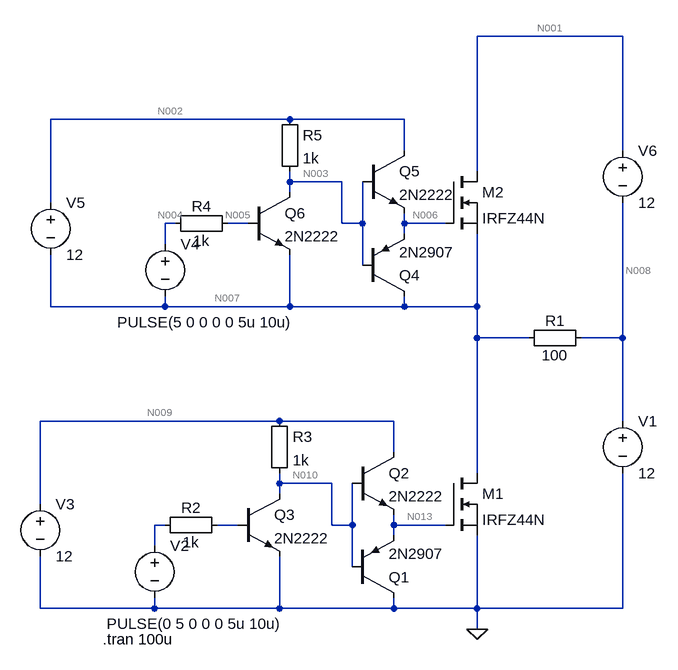
[diagram p0: schematic Drive4.asc]
Drive4.asc, the LTspice schematic file:
Version 4
SHEET 1 880 1392
WIRE -2688 448 -2912 448
WIRE -3200 576 -3568 576
WIRE -3024 576 -3200 576
WIRE -3024 624 -3024 576
WIRE -2688 624 -2688 448
WIRE -2912 656 -2912 448
WIRE -3200 672 -3200 656
WIRE -3120 672 -3200 672
WIRE -3200 688 -3200 672
WIRE -3568 704 -3568 576
WIRE -3376 736 -3392 736
WIRE -3264 736 -3296 736
WIRE -3120 736 -3120 672
WIRE -3088 736 -3088 672
WIRE -3088 736 -3120 736
WIRE -3024 736 -3024 720
WIRE -2960 736 -3024 736
WIRE -3024 752 -3024 736
WIRE -3392 768 -3392 736
WIRE -3088 800 -3088 736
WIRE -3568 864 -3568 784
WIRE -3392 864 -3392 848
WIRE -3392 864 -3568 864
WIRE -3200 864 -3200 784
WIRE -3200 864 -3392 864
WIRE -3024 864 -3024 848
WIRE -3024 864 -3200 864
WIRE -2912 864 -2912 752
WIRE -2912 864 -3024 864
WIRE -2912 912 -2912 864
WIRE -2832 912 -2912 912
WIRE -2688 912 -2688 704
WIRE -2688 912 -2752 912
WIRE -3216 1040 -3584 1040
WIRE -3040 1040 -3216 1040
WIRE -2688 1040 -2688 912
WIRE -3040 1088 -3040 1040
WIRE -2912 1120 -2912 912
WIRE -3216 1136 -3216 1120
WIRE -3136 1136 -3216 1136
WIRE -3216 1152 -3216 1136
WIRE -3584 1168 -3584 1040
WIRE -3392 1200 -3408 1200
WIRE -3280 1200 -3312 1200
WIRE -3136 1200 -3136 1136
WIRE -3104 1200 -3104 1136
WIRE -3104 1200 -3136 1200
WIRE -3040 1200 -3040 1184
WIRE -2960 1200 -3040 1200
WIRE -3040 1216 -3040 1200
WIRE -3408 1232 -3408 1200
WIRE -3104 1264 -3104 1200
WIRE -3584 1328 -3584 1248
WIRE -3408 1328 -3408 1312
WIRE -3408 1328 -3584 1328
WIRE -3216 1328 -3216 1248
WIRE -3216 1328 -3408 1328
WIRE -3040 1328 -3040 1312
WIRE -3040 1328 -3216 1328
WIRE -2912 1328 -2912 1216
WIRE -2912 1328 -3040 1328
WIRE -2688 1328 -2688 1120
WIRE -2688 1328 -2912 1328
WIRE -2912 1360 -2912 1328
FLAG -2912 1360 0
SYMBOL nmos -2960 1120 R0
SYMATTR InstName M1
SYMATTR Value IRFZ44N
SYMBOL voltage -2688 1024 R0
WINDOW 123 0 0 Left 0
WINDOW 39 0 0 Left 0
SYMATTR InstName V1
SYMATTR Value 12
SYMBOL Misc\\EuropeanResistor -2736 896 R90
WINDOW 0 5 56 VBottom 2
WINDOW 3 27 56 VTop 2
SYMATTR InstName R1
SYMATTR Value 100
SYMBOL Misc\\EuropeanResistor -3408 1216 R270
WINDOW 0 27 56 VTop 2
WINDOW 3 5 56 VBottom 2
SYMATTR InstName R2
SYMATTR Value 1k
SYMBOL voltage -3408 1216 R0
WINDOW 3 -74 136 Left 2
WINDOW 123 0 0 Left 0
WINDOW 39 0 0 Left 0
SYMATTR Value PULSE(0 5 0 0 0 5u 10u)
SYMATTR InstName V2
SYMBOL pnp -3104 1312 M180
SYMATTR InstName Q1
SYMATTR Value 2N2907
SYMBOL npn -3104 1088 R0
SYMATTR InstName Q2
SYMATTR Value 2N2222
SYMBOL voltage -3584 1152 R0
WINDOW 123 0 0 Left 0
WINDOW 39 0 0 Left 0
SYMATTR InstName V3
SYMATTR Value 12
SYMBOL Misc\\EuropeanResistor -3232 1024 R0
SYMATTR InstName R3
SYMATTR Value 1k
SYMBOL npn -3280 1152 R0
SYMATTR InstName Q3
SYMATTR Value 2N2222
SYMBOL nmos -2960 656 R0
SYMATTR InstName M2
SYMATTR Value IRFZ44N
SYMBOL Misc\\EuropeanResistor -3392 752 R270
WINDOW 0 27 56 VTop 2
WINDOW 3 5 56 VBottom 2
SYMATTR InstName R4
SYMATTR Value 1k
SYMBOL voltage -3392 752 R0
WINDOW 3 -74 136 Left 2
WINDOW 123 0 0 Left 0
WINDOW 39 0 0 Left 0
SYMATTR Value PULSE(5 0 0 0 0 5u 10u)
SYMATTR InstName V4
SYMBOL pnp -3088 848 M180
SYMATTR InstName Q4
SYMATTR Value 2N2907
SYMBOL npn -3088 624 R0
SYMATTR InstName Q5
SYMATTR Value 2N2222
SYMBOL Misc\\EuropeanResistor -3216 560 R0
SYMATTR InstName R5
SYMATTR Value 1k
SYMBOL npn -3264 688 R0
SYMATTR InstName Q6
SYMATTR Value 2N2222
SYMBOL voltage -3568 688 R0
WINDOW 123 0 0 Left 0
WINDOW 39 0 0 Left 0
SYMATTR InstName V5
SYMATTR Value 12
SYMBOL voltage -2688 608 R0
WINDOW 123 0 0 Left 0
WINDOW 39 0 0 Left 0
SYMATTR InstName V6
SYMATTR Value 12
TEXT -3488 1376 Left 2 !.tran 100u

The netlist it stands for:
* Drive4.asc
M1 N007 N013 0 0 IRFZ44N
V1 N008 0 12
R1 N008 N007 100
R2 N011 N012 1k
V2 N011 0 PULSE(0 5 0 0 0 5u 10u)
Q1 0 N010 N013 0 2N2907
Q2 N009 N010 N013 0 2N2222
V3 N009 0 12
R3 N009 N010 1k
Q3 N010 N012 0 0 2N2222
M2 N001 N006 N007 N007 IRFZ44N
R4 N004 N005 1k
V4 N004 N007 PULSE(5 0 0 0 0 5u 10u)
Q4 N007 N003 N006 0 2N2907
Q5 N002 N003 N006 0 2N2222
R5 N002 N003 1k
Q6 N003 N005 N007 0 2N2222
V5 N002 N007 12
V6 N001 N008 12
.model NPN NPN
.model PNP PNP
.lib standard.bjt
.model NMOS NMOS
.model PMOS PMOS
.lib standard.mos
.tran 100u
.backanno
.end

* Results of the author's LTspice run, read from the files saved beside the schematic
* Operating Point, zero values left out:
*   V(n007) = 1.389 mV
*   V(n013) = 12 V
*   V(n008) = 12 V
*   V(n010) = 12 V
*   V(n009) = 12 V
*   V(n001) = 24 V
*   V(n006) = 32.88 mV
*   V(n004) = 5.001 V
*   V(n005) = 789.7 mV
*   V(n003) = 31.35 mV
*   V(n002) = 12 V
*   Ic(Q6) = 11.97 mA
*   Ib(Q6) = 4.212 mA
*   Ie(Q6) = -16.18 mA
*   Ic(Q5) = 11.98 pA
*   Ib(Q5) = -11.97 pA
*   Ic(Q3) = 12.01 pA
*   Ib(Q3) = -12 pA
*   Ic(Q1) = -12.01 pA
*   Ib(Q1) = 12 pA
*   Id(M2) = 25.6 pA
*   Is(M2) = -25.6 pA
*   Id(M1) = 120 mA
*   Is(M1) = -120 mA
*   I(R5) = 11.97 mA
*   I(R4) = 4.212 mA
*   I(R3) = 24.02 pA
*   I(R2) = -12 pA
*   I(R1) = 120 mA
*   I(V6) = -50.02 pA
*   I(V5) = -11.97 mA
*   I(V4) = -4.212 mA
*   I(V3) = -24.02 pA
*   I(V2) = 12 pA
*   I(V1) = -120 mA
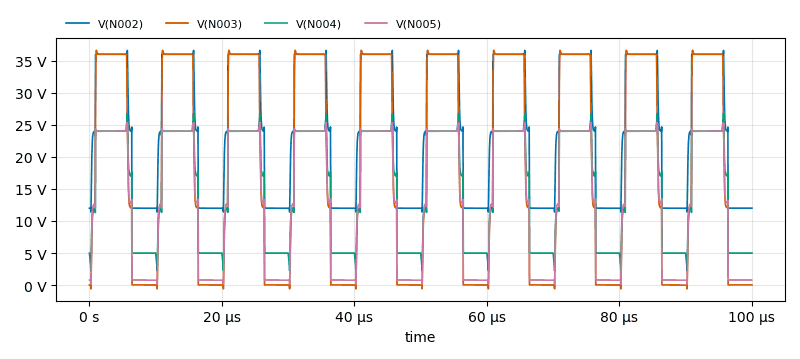
[diagram p1: Transient Analysis of Drive4.asc, plotted from the saved traces]
* Transient Analysis, 1 run:
*   V(N002): min 11.39 V, max 36.61 V, average 25.2 V, rms 27.58 V, last 12 V
*   V(N003): min -575.8 mV, max 36.6 V, average 18.93 V, rms 25.33 V, last 31.36 mV
*   V(N004): min 2.233 V, max 26.77 V, average 15.45 V, rms 17.89 V, last 5.001 V
*   V(N005): min 158.4 mV, max 25.33 V, average 13.62 V, rms 17.41 V, last 789.7 mV